# Altium schematic sheet schematic sheet2.SchDoc
size A; SheetNumber: 2; SheetTotal: 2
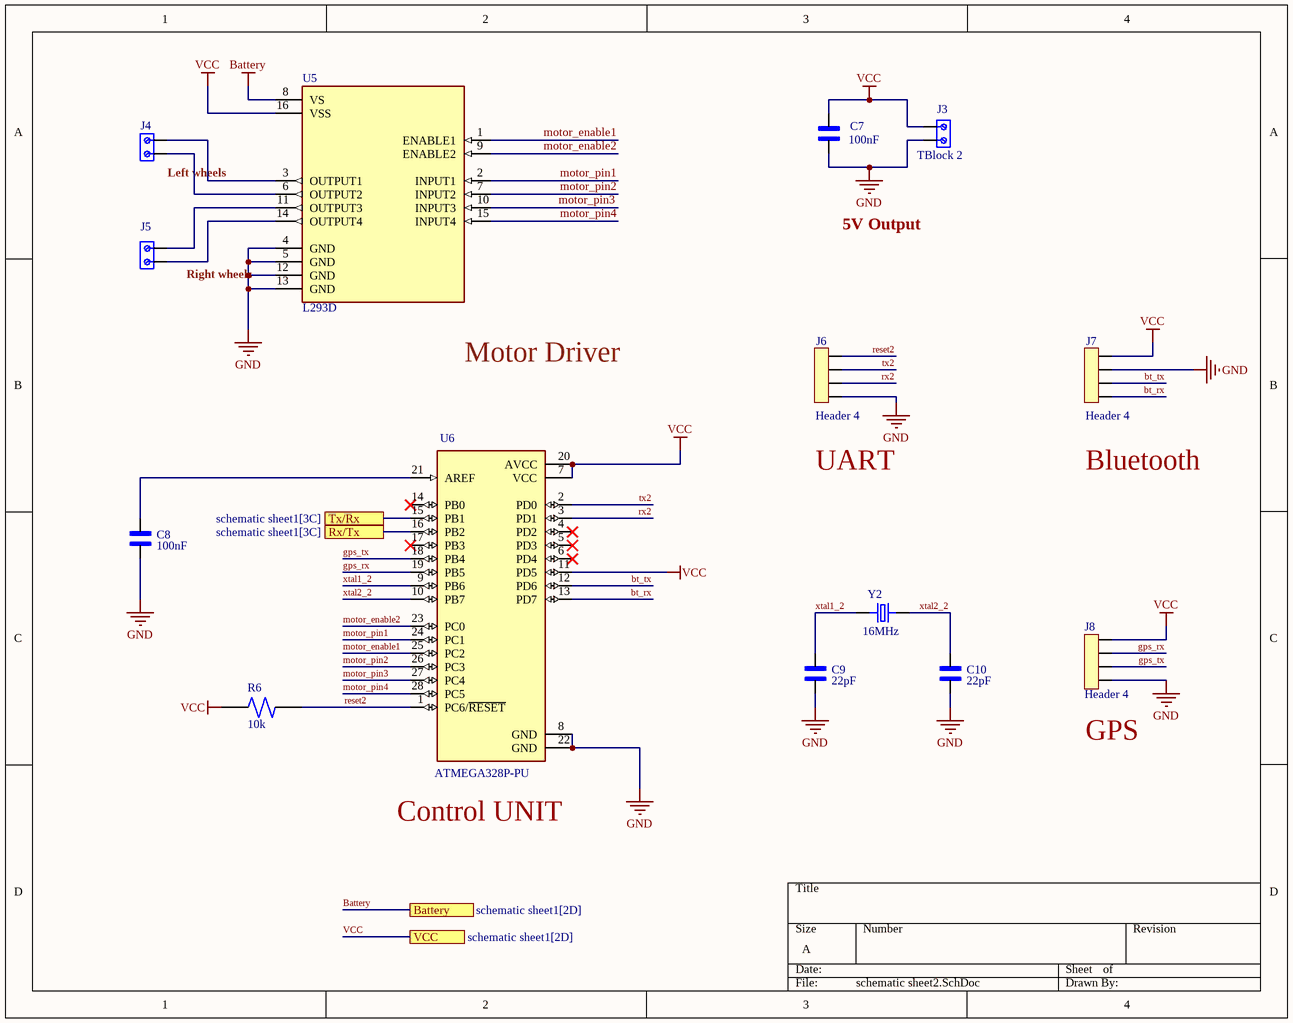
[diagram p0: schematic sheet2.SchDoc]

## Parts
C7  100nF  [CAPRB500W50L450T300H550]
C8  100nF  [CAPRB500W50L450T300H550]
C9  22pF  [CAPRB500W50L450T300H550]
C10  22pF  [CAPRB500W50L450T300H550]
J3  TBlock 2  [691111710002]
J4  691111710002  [691111710002]  (value not drawn)
J5  691111710002  [691111710002]  (value not drawn)
J6  Header 4  [SULLINS_PPTC041LFBN-RC]
J7  Header 4  [SULLINS_PPTC041LFBN-RC]
J8  Header 4  [SULLINS_PPTC041LFBN-RC]
R6  10k  [RESAD1100W55L680D260]
U5  L293D  [DIP880W50P254L2000H510Q16]
U6  ATMEGA328P-PU  [DIP794W46P254L2967H457Q28B]
Y2  16MHz  [XTAL_ECS-160-20-4X]

## Ports
Battery (see schematic sheet1[2D]), Rx/Tx (see schematic sheet1[3C]), Tx/Rx (see schematic sheet1[3C]), VCC (see schematic sheet1[2D])

## Nets
Battery: U5.8(VS) ; port Battery
GND: C7.1 C8.2 C9.2 C10.2 J3.2 J6.4 J7.2 J8.1 U5.4(GND) U5.5(GND) U5.12(GND) U5.13(GND) U6.8(GND) U6.22(GND)
VCC: C7.2 J3.1 J7.1 J8.4 R6.1 U5.16(VSS) U6.7(VCC) U6.11(PD5) U6.20(AVCC) ; port VCC
bt_rx: J7.4 U6.13(PD7)
bt_tx: J7.3 U6.12(PD6)
gps_rx: J8.3 U6.19(PB5)
gps_tx: J8.2 U6.18(PB4)
motor_enable1: U5.1(ENABLE1) U6.25(PC2)
motor_enable2: U5.9(ENABLE2) U6.23(PC0)
motor_pin1: U5.2(INPUT1) U6.24(PC1)
motor_pin2: U5.7(INPUT2) U6.26(PC3)
motor_pin3: U5.10(INPUT3) U6.27(PC4)
motor_pin4: U5.15(INPUT4) U6.28(PC5)
reset2: J6.1 R6.2 U6.1(PC6/~{RESET})
rx2: J6.3 U6.3(PD1)
Rx/Tx: U6.16(PB2) ; port Rx/Tx
tx2: J6.2 U6.2(PD0)
Tx/Rx: U6.15(PB1) ; port Tx/Rx
xtal1_2: C9.1 U6.9(PB6) Y2.1
xtal2_2: C10.1 U6.10(PB7) Y2.2
NetC8_1: C8.1 U6.21(AREF)
NetJ4_1: J4.1 U5.3(OUTPUT1)
NetJ4_2: J4.2 U5.6(OUTPUT2)
NetJ5_1: J5.1 U5.11(OUTPUT3)
NetJ5_2: J5.2 U5.14(OUTPUT4)

Not connected (* = marked no-connect by the designer): U6 4(PD2)* 5(PD3)* 6(PD4)* 14(PB0)* 17(PB3)*

## Notes on the sheet
- (near J4) Left wheels
- 5V Output
- (near J5) Right wheels
- (near U5) Motor Driver
- (near J6) UART
- (near J7) Bluetooth
- (near J8) GPS
- (near U6) Control UNIT

## Library data of the parts
C7-C10 = Ceramic capacitor: 2200 pF Â±10% 250V Ceramic Capacitor X7R Radial; MF: TDK; MP: FG24X7R2E222KNT06; Digi-Key_Part_Number: 445-173386-1-ND; Purchase-URL: https://pricing.snapeda.com/search/part/FG24X7R2E222KNT06/?ref=eda; Check_prices: https://www.snapeda.com/parts/FG24X7R2E222KNT06/TDK/view-part/?ref=eda; Value: *; Package: Radial TDK; SnapEDA_Link: https://www.snapeda.com/parts/FG24X7R2E222KNT06/TDK/view-part/?ref=snap
J3-J5 = Terminal Block - 2Pins: 2 Position Wire to Board Terminal Block Horizontal with Board 0.197 _5.00mm_ Through Hole; MF: Wurth Electronics; Value: *; Availability: Unavailable; MP: 691111710002; Price: None; Package: None; SnapEDA_Link: https://www.snapeda.com/parts/691111710002/Wurth%20Electronics%20Inc./view-part/1195092/?ref=snap
J6-J8 = Female header - 4Pins: 4 Position Header Connector Through Hole; MP: PPTC041LFBN-RC; MF: Sullins Connector; Value: *; SnapEDA_Link: https://www.snapeda.com/parts/PPTC041LFBN-RC/Sullins%20Connector%20Solutions/view-part/285917/?ref=snap; Package: None; Availability: Warning; Check_prices: https://www.snapeda.com/parts/PPTC041LFBN-RC/Sullins%20Connector%20Solutions/view-part/285917/?ref=eda; Price: None; Purchase-URL: https://pricing.snapeda.com/search/part/PPTC041LFBN-RC/?ref=eda
R6 = Resistor (0.25W): (MFR-25FBF52-10K) 10,2 kOhm bei 1% 0,25W, 1/4W Durchbohrlochwiderstand Axial Metal Film; MF: Yageo; Digi-Key_Part_Number: 10.2KXBK-ND; SnapEDA_Link: https://www.snapeda.com/parts/MFR-25FBF52-10K/Yageo/view-part/424333/?ref=snap; Package: Axial Yageo; Purchase-URL: https://pricing.snapeda.com/search/part/MFR-25FBF52-10K/?ref=eda; MP: MFR-25FBF52-10K; Value: *
U5 = L293D: 4-Channel Motor Driver 24V 16-Pin Power PDIP Tube; Price: None; Package: None; Availability: Unavailable; MP: L293D; Value: *
U6 = ATMEGA328P-PU: ATmega Series 20 MHz 32 KB Flash 2 KB SRAM 8-Bit Microcontroller - DIP-28; Value: *; MP: ATMEGA328P-PU; Package: None; Availability: Unavailable; Price: None
Y2 = Crystal oscilator: CRYSTAL T/H; MF: {'manufacturer': u'ECS Inc.'}; MP: ECS-160-S-4; Package: None; Value: *; Availability: Unavailable; Price: None